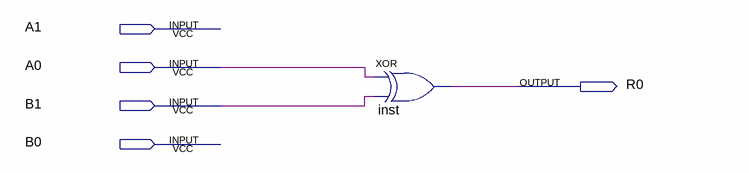
[diagram p0: schematic sheet]
// Quartus schematic LAB03_BlockR0.bdf as structural Verilog: 1 symbols, 5 pins
module LAB03_BlockR0 (
  input  A1,
  input  A0,
  input  B1,
  input  B0,
  output R0
);

  xor inst (R0, A0, B1);
endmodule
